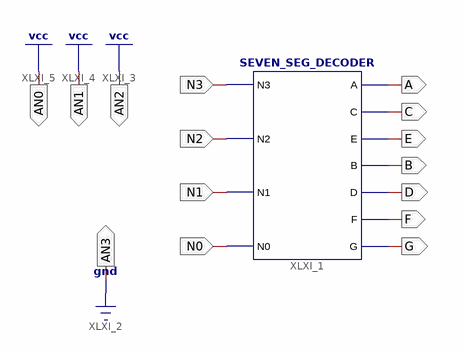
[diagram p0: schematic sheet 1]
// Xilinx ISE schematic Test_bench.sch (spartan3e) as structural Verilog: 1 symbols, 15 ports
module Test_bench (
  input  N3,
  input  N2,
  input  N1,
  input  N0,
  output A,
  output C,
  output E,
  output B,
  output D,
  output F,
  output G,
  output AN2,
  output AN0,
  output AN1,
  output AN3
);

  SEVEN_SEG_DECODER XLXI_1 (.N3(N3), .N2(N2), .N1(N1), .N0(N0), .A(A), .C(C), .E(E), .B(B), .D(D), .F(F), .G(G));

  assign AN0 = 1'b1;
  assign AN1 = 1'b1;
  assign AN2 = 1'b1;
  assign AN3 = 1'b0;
endmodule
